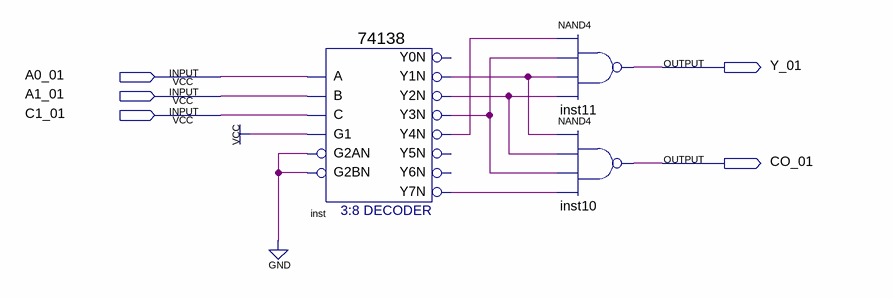
[diagram p0: schematic sheet]
// Quartus schematic minu_time1.bdf as structural Verilog: 3 symbols, 5 pins
module minu_time1 (
  input  A0_01,
  input  A1_01,
  input  C1_01,
  output Y_01,
  output CO_01
);

  wire inst_y1n, inst_y2n, inst_y3n, inst_y4n, inst_y7n;

  \74138  inst (
    .A(A0_01), .B(A1_01), .G1(1'b1), .C(C1_01), .G2AN(1'b0), .G2BN(1'b0), .Y1N(inst_y1n), .Y2N(inst_y2n),
    .Y3N(inst_y3n), .Y4N(inst_y4n), .Y7N(inst_y7n));  // open: Y0N, Y5N, Y6N
  nand inst11 (Y_01, inst_y4n, inst_y3n, inst_y1n, inst_y2n);
  nand inst10 (CO_01, inst_y1n, inst_y2n, inst_y3n, inst_y7n);
endmodule
